# EAGLE design controllerM2 (EAGLE 7.6.0)
CNAME: timebox controller; CREVISION: 1.0; DESIGNER: volzo
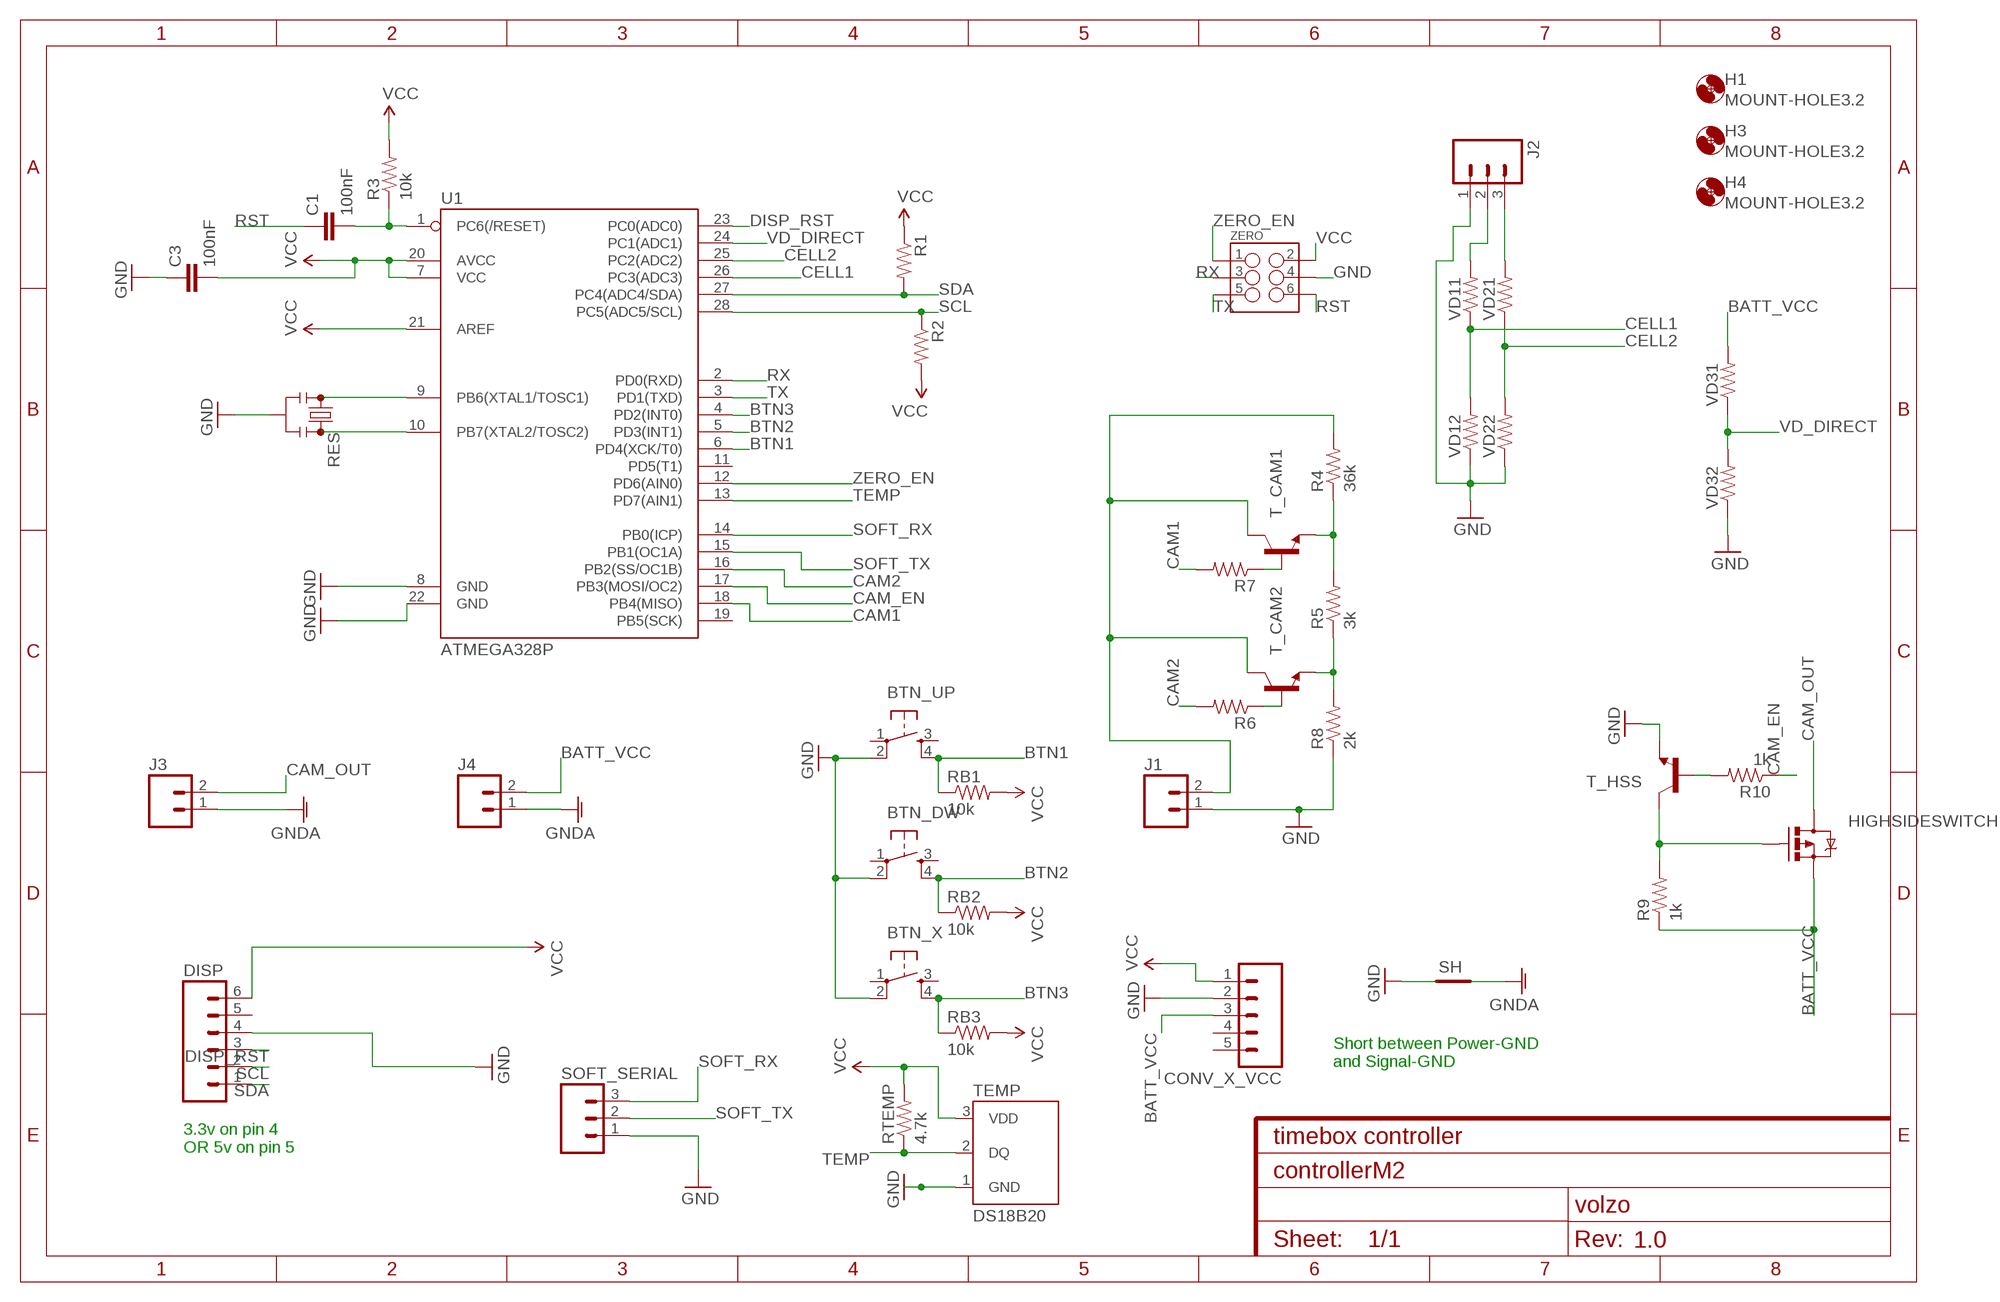
[diagram p0: schematic, sheet 1]

## Parts
BTN_DW  TAC_SWITCHPTH  [TACTILE-PTH]
BTN_UP  TAC_SWITCHPTH  [TACTILE-PTH]
BTN_X  TAC_SWITCHPTH  [TACTILE-PTH]
C1  100nF  CAPPTH  [CAP-PTH-SMALL]
C3  100nF  CAPPTH  [CAP-PTH-SMALL]
CONV_X_VCC  M05LOCK  [1X05_LOCK]
DISP  M06FEMALE_LOCK  [1X06_FEMALE_LOCK.010]
H1  MOUNT-HOLE3.2  [3,2]
H3  MOUNT-HOLE3.2  [3,2]
H4  MOUNT-HOLE3.2  [3,2]
HIGHSIDESWITCH  MOSFET-PCHANNELNDP6020P_20V_24A_LOW_VGS_TH  [TO220V]
J1  M02LOCK  [1X02_LOCK]
J2  M03LOCK  [1X03_LOCK]
J3  M023.5MM_LOCK  [SCREWTERMINAL-3.5MM-2_LOCK]
J4  M023.5MM_LOCK  [SCREWTERMINAL-3.5MM-2_LOCK]
R1  RESISTORAXIAL-0.3  [AXIAL-0.3]
R2  RESISTORAXIAL-0.3  [AXIAL-0.3]
R3  10k  RESISTORAXIAL-0.3  [AXIAL-0.3]
R4  36k  RESISTORAXIAL-0.3  [AXIAL-0.3]
R5  3k  RESISTORAXIAL-0.3  [AXIAL-0.3]
R6  RESISTORAXIAL-0.3  [AXIAL-0.3]
R7  RESISTORAXIAL-0.3  [AXIAL-0.3]
R8  2k  RESISTORAXIAL-0.3  [AXIAL-0.3]
R9  1k  RESISTORAXIAL-0.3  [AXIAL-0.3]
R10  1k  RESISTORAXIAL-0.3  [AXIAL-0.3]
RB1  10k  RESISTORAXIAL-0.3  [AXIAL-0.3]
RB2  10k  RESISTORAXIAL-0.3  [AXIAL-0.3]
RB3  10k  RESISTORAXIAL-0.3  [AXIAL-0.3]
RES  RESONATORPTH  [RESONATOR-PTH]
RTEMP  4.7k  RESISTORAXIAL-0.3  [AXIAL-0.3]
SH  SHORT-HT5  [SHORT_TOP-50]
SOFT_SERIAL  M03LOCK  [1X03_LOCK]
T_CAM1  TRANSISTOR_NPN2N3904  [TO-92]
T_CAM2  TRANSISTOR_NPN2N3904  [TO-92]
T_HSS  TRANSISTOR_NPN2N3904  [TO-92]
TEMP  DS18B20  [TO-92-AMMO]
U1  ATMEGA328P  ATMEGA328P_PDIP  [DIL28-3]
VD11  RESISTORAXIAL-0.3  [AXIAL-0.3]
VD12  RESISTORAXIAL-0.3  [AXIAL-0.3]
VD21  RESISTORAXIAL-0.3  [AXIAL-0.3]
VD22  RESISTORAXIAL-0.3  [AXIAL-0.3]
VD31  RESISTORAXIAL-0.3  [AXIAL-0.3]
VD32  RESISTORAXIAL-0.3  [AXIAL-0.3]
ZERO  M03X2FEMALE  [2X3]

## Nets
BATT_VCC [power]: CONV_X_VCC.3 HIGHSIDESWITCH.3(S) J4.2 R9.P$1 VD31.P$2
BTN1: BTN_UP.4 RB1.P$1 U1.6(PD4(XCK/T0))
BTN2: BTN_DW.4 RB2.P$1 U1.5(PD3(INT1))
BTN3: BTN_X.4 RB3.P$1 U1.4(PD2(INT0))
CAM1: R7.P$2 U1.18(PB4(MISO))
CAM2: R6.P$2 U1.16(PB2(SS/OC1B))
CAM_EN: R10.P$1 U1.17(PB3(MOSI/OC2))
CAM_OUT [power]: HIGHSIDESWITCH.2(D) J3.2
CELL1: U1.26(PC3(ADC3)) VD11.P$1 VD12.P$2
CELL2: U1.25(PC2(ADC2)) VD21.P$1 VD22.P$2
DISP_RST: DISP.3 U1.23(PC0(ADC0))
GND: BTN_DW.2 BTN_UP.2 BTN_X.2 C3.1 CONV_X_VCC.2 DISP.4 J1.1 J2.1 R8.P$1 RES.2 SH.1 SOFT_SERIAL.1 T_HSS.1(E) TEMP.1(GND) U1.8(GND) U1.22(GND) VD12.P$1 VD22.P$1 VD32.P$1 ZERO.4
GNDA [power]: J3.1 J4.1 SH.2
N$1: C1.2 R3.P$1 U1.1(PC6(/RESET))
N$2: J2.2 VD11.P$2
N$3: R7.P$1 T_CAM1.2(B)
N$5: J2.3 VD21.P$2
N$7: J1.2 R4.P$2 T_CAM1.3(C) T_CAM2.3(C)
N$8: RES.3 U1.10(PB7(XTAL2/TOSC2))
N$9: RES.1 U1.9(PB6(XTAL1/TOSC1))
N$11: R6.P$1 T_CAM2.2(B)
N$13: R10.P$2 T_HSS.2(B)
N$14: HIGHSIDESWITCH.1(G) R9.P$2 T_HSS.3(C)
N$16: R4.P$1 R5.P$2 T_CAM1.1(E)
N$17: R5.P$1 R8.P$2 T_CAM2.1(E)
RST: C1.1 ZERO.6
RX: U1.2(PD0(RXD)) ZERO.3
SCL: DISP.2 R2.P$1 U1.28(PC5(ADC5/SCL))
SDA: DISP.1 R1.P$2 U1.27(PC4(ADC4/SDA))
SOFT_RX: SOFT_SERIAL.3 U1.14(PB0(ICP))
SOFT_TX: SOFT_SERIAL.2 U1.15(PB1(OC1A))
TEMP: RTEMP.P$1 TEMP.2(DQ) U1.13(PD7(AIN1))
TX: U1.3(PD1(TXD)) ZERO.5
VCC: C3.2 CONV_X_VCC.1 DISP.6 R1.P$1 R2.P$2 R3.P$2 RB1.P$2 RB2.P$2 RB3.P$2 RTEMP.P$2 TEMP.3(VDD) U1.7(VCC) U1.20(AVCC) U1.21(AREF) ZERO.2
VD_DIRECT: U1.24(PC1(ADC1)) VD31.P$1 VD32.P$2
ZERO_EN: U1.12(PD6(AIN0)) ZERO.1
Unconnected: BTN_DW.1 BTN_DW.3 BTN_UP.1 BTN_UP.3 BTN_X.1 BTN_X.3 CONV_X_VCC.4 CONV_X_VCC.5 DISP.5 U1.11(PD5(T1)) U1.19(PB5(SCK))

## Notes on the sheet
- Short between Power-GND
  and Signal-GND
- 3.3v on pin 4
  OR 5v on pin 5

## Library data of the parts
BTN_DW BTN_UP BTN_X = SparkFun-Retired:TAC_SWITCH: Momentary Switch Button commonly used for reset or general input. Spark Fun Electronics SKU : COM-00097 SMT- SWCH-08247
C1 C3 = SparkFun-Passives:CAP: Capacitor Standard 0603 ceramic capacitor, and 0.1" leaded capacitor.
CONV_X_VCC = SparkFun-Connectors:M05: Header 5 Standard 5-pin 0.1" header. Use with straight break away headers (SKU : PRT-00116), right angle break away headers (PRT-00553), swiss pins (PRT-00743), machine pins (PRT-00117), and female headers (PRT-00115). Molex polarized connector foot print use with SKU : PRT-08230 with associated crimp pins and housings.
DISP = SparkFun-Connectors:M06: Header 6 Standard 6-pin 0.1" header. Use with straight break away headers (SKU : PRT-00116), right angle break away headers (PRT-00553), swiss pins (PRT-00743), machine pins (PRT-00117), and female headers (PRT-00115). Molex polarized connector foot print use with SKU : PRT-08094 with associated crimp pins and housings. NOTES ON THE VARIANTS LOCK and LOCK_LONGPADS... This footprint was designed to help hold the alignment of a through-hole component (i.e. 6-pin header) while soldering it into place. You may notice that each hole has been shifted either up or down by 0.005 of an inch from it's more standard position (which is a perfectly straight line). This slight alteration caused the pins (the squares in the middle) to touch the edges of the holes. Because they are alternating, it causes a "brace" to hold the component in place. 0.005 has proven to be the perfect amount of "off-center" position when using our standard breakaway headers. Although looks a little odd when you look at the bare footprint, once you have a header in there, the alteration is very hard to notice. Also,if you push a header all the way into place, it is covered up entirely on the bottom side. This idea of altering the position of holes to aid alignment will be further integrated into the Sparkfun Library for other footprints. It can help hold any component with 3 or more connection pins.
H1 H3 H4 = holes:MOUNT-HOLE: MOUNTING HOLE with drill center marker
HIGHSIDESWITCH = SparkFun-DiscreteSemi:MOSFET-PCHANNEL: Generic PMOSFET IRLML2244 - TRANS-11153 (SOT-23 -20V -4.3A) (1.Gate 2.Source 3.Drain) FQP27P06 - COM-10349 <http://www.sparkfun.com/products/10349> (TO-220 -60V -27A) (1.Gate 2.Source 3.Drain); PROD_ID: TRANS-13060
J1 = SparkFun-Connectors:M02: Standard 2-pin 0.1" header. Use with - straight break away headers ( PRT-00116) - right angle break away headers (PRT-00553) - swiss pins (PRT-00743) - machine pins (PRT-00117) - female headers (PRT-00115) Molex polarized connector foot print use with: PRT-08233 with associated crimp pins and housings. 2.54_SCREWTERM for use with PRT-10571. 3.5mm Screw Terminal footprints for PRT-08084 5mm Screw Terminal footprints for use with PRT-08432
J2 SOFT_SERIAL = SparkFun-Connectors:M03: Header 3 Standard 3-pin 0.1" header. Use with straight break away headers (SKU : PRT-00116), right angle break away headers (PRT-00553), swiss pins (PRT-00743), machine pins (PRT-00117), and female headers (PRT-00115). Molex polarized connector foot print use with SKU : PRT-08232 with associated crimp pins and housings.
J3 J4 = SparkFun-Connectors:M02: Standard 2-pin 0.1" header. Use with - straight break away headers ( PRT-00116) - right angle break away headers (PRT-00553) - swiss pins (PRT-00743) - machine pins (PRT-00117) - female headers (PRT-00115) Molex polarized connector foot print use with: PRT-08233 with associated crimp pins and housings. 2.54_SCREWTERM for use with PRT-10571. 3.5mm Screw Terminal footprints for PRT-08084 5mm Screw Terminal footprints for use with PRT-08432; PROD_ID: CONN-08399
R1-R10 RB1-RB3 RTEMP VD11 VD12 VD21 VD22 VD31 VD32 = SparkFun-Resistors:RESISTOR: Resistor Basic schematic elements and footprints for 0603, 1206, and PTH resistors.
RES = SparkFun-FreqCtrl:RESONATOR: Resonator Small SMD resonator. Used, eg, on the Arduino Pro/ Pro Mini boards. 8MHz- XTAL-08895 16MHz- XTAL-08900
SH = shorts-old:SHORT-H: Short between two nets; BOM: no
T_CAM1 T_CAM2 T_HSS = SparkFun-DiscreteSemi:TRANSISTOR_NPN: Generic NPN BJT MMBT2222A - TRANS-08049 (SOT-23, 1A 40V) MPSA42 - TRANS-09116 (SOT-23, 500mA 300V) MMBT5088LT1G - TRANS-11160 (SOT-23, 50 mA 30V) BC547 - COM-08928 <http://www.sparkfun.com/products/8928> (TO-92 45V 100mA) (1.Collector 2.Base 3.Emitter) 2N3904 - COM-00521 <http://www.sparkfun.com/products/521> (TO-92 40V 200mA) (1.Emitter 2.Base 3.Collector) P2N2222A - COM-12852 <http://www.sparkfun.com/products/12852> (TO-92 40V 600mA) (1.Collector 2.Base 3.Emitter); PROD_ID: TRANS-08447
TEMP = SparkFun-Sensors:DS18B20: Dallas/Maxim DS18B20 1-wire temperature sensor Datasheet: http://datasheets.maximintegrated.com/en/ds/DS18B20.pdf temp thermometer 1-wire one-wire one wire; STORE_ID: SEN-00245
U1 = SparkFun-DigitalIC:ATMEGA328P_PDIP: uC used in the Arduino 32kb flash, 1k EEPROM, 2k SRAM This is the through-hole version of this chip.
ZERO = SparkFun-Connectors:M03X2: 2x3 .1" header. Shrouded, with keying- CONN-10681 SMT- CONN-11415 Pogo pins- HW-11044; PROD_ID: CONN-11566; VALUE: FEMALE 2x3

## Net classes
0 default: width 0.305 mm, clearance 0.254 mm
1 power: width 0.762 mm, clearance 0.254 mm

## Board
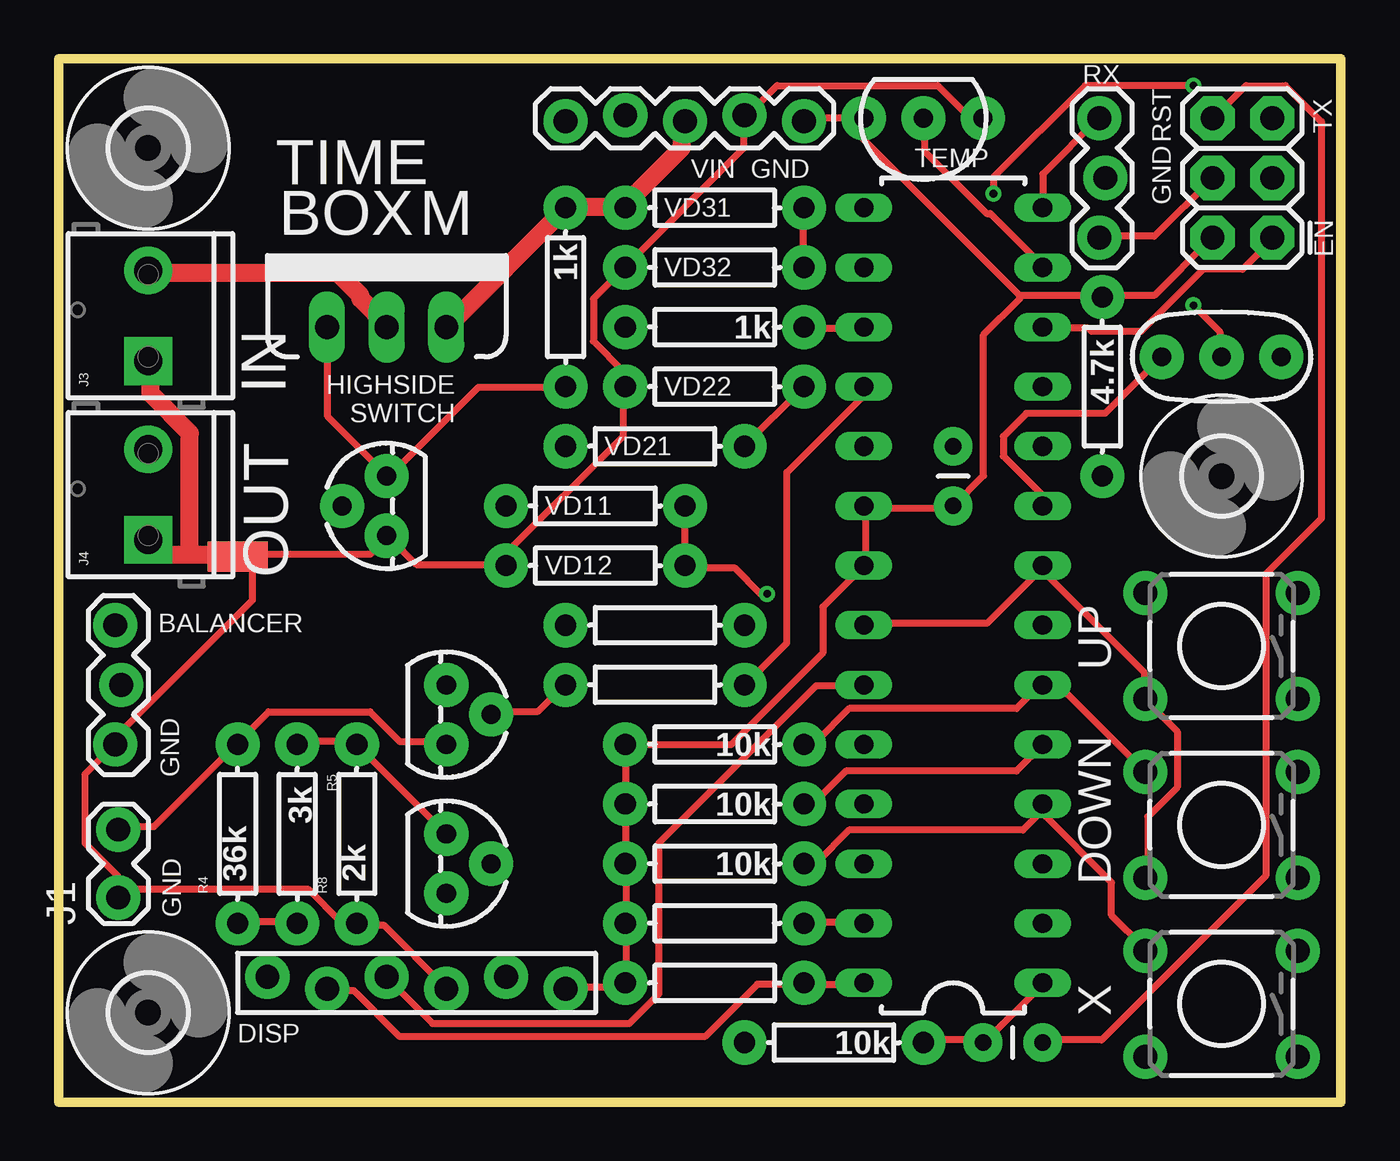
[diagram p1: board, top side]
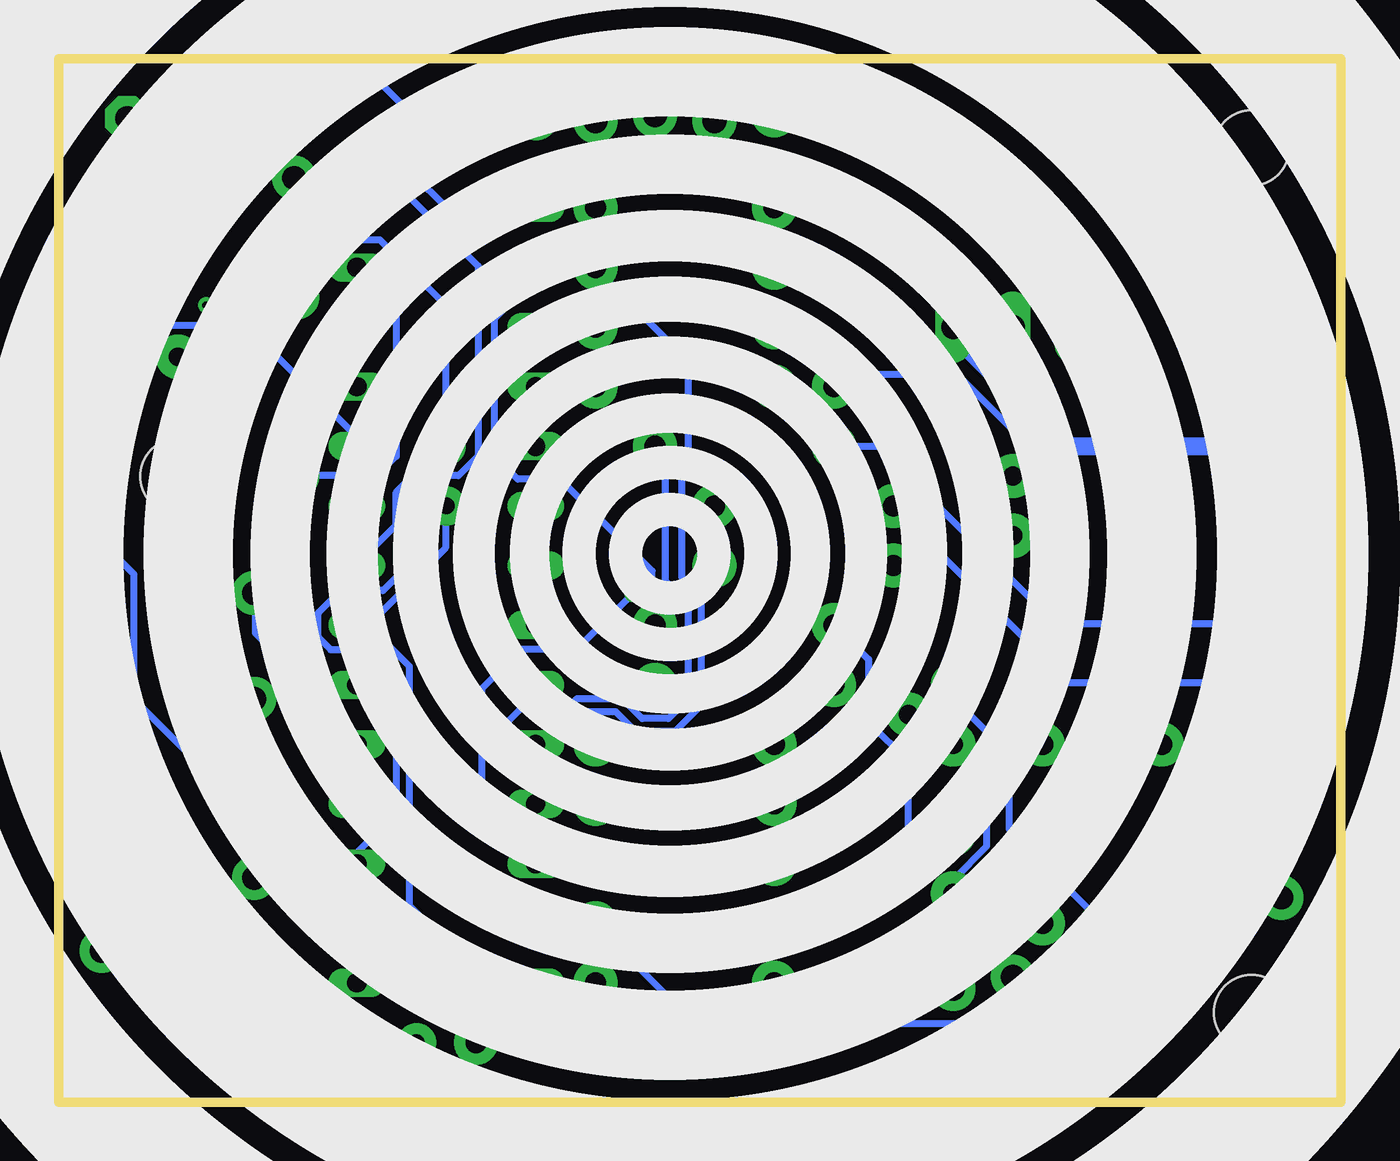
[diagram p2: board, bottom side, seen from below]

Size 54.61 x 44.45 mm. Coordinates in mm from the lower left corner, seen from the top.
Outline: 0,0 54.61,0 54.61,44.45 0,44.45 0,0
Copper layers (1*16): Top 0.0356mm / dielectric 1.5011mm / Bottom 0.0356mm
Design rules "oshpark-2layer *": minimum track width 6mil, minimum drill 13mil, track to track 10mil, track to pad 10mil, pad to pad 10mil, via to via 10mil, smd to smd 10mil, copper to edge 15mil, drill to drill 6mil, minimum pad ring 7mil, minimum via ring 7mil, stop-mask expansion 2.5mil, vias tented up to drill 0mil, thermal gap 10mil

### Footprints (pad centres in the part's own frame; a part is rotated, then mirrored left to right if it is on the bottom)
TACTILE-PTH = drill 1.016 pad 1.88: 1 -3.251,2.261; 2 3.251,2.261; 3 -3.251,-2.261; 4 3.251,-2.261
CAP-PTH-SMALL = drill 0.7 pad 1.651: 1 0,0; 2 2.54,0
1X05_LOCK = drill 1.016 pad 1.88: 1 0,0.127; 2 2.54,-0.127; 3 5.08,0.127; 4 7.62,-0.127; 5 10.16,0.127
1X06_FEMALE_LOCK.010 = drill 1.016 pad 1.88: 1 0,0.254; 2 2.54,-0.254; 3 5.08,0.254; 4 7.62,-0.254; 5 10.16,0.254; 6 12.7,-0.254
3,2 = hole 3.2: 0,0
TO220V = drill 1.016 long: 1 -2.54,0; 2 0,0; 3 2.54,0
1X02_LOCK = drill 1.016 pad 1.88: 1 -0.178,0; 2 2.718,0
1X03_LOCK = drill 1.016 pad 1.88: 1 0,0.127; 2 2.54,-0.127; 3 5.08,0.127
SCREWTERMINAL-3.5MM-2_LOCK = drill 1.2 pad 2.032 square: 1 -0.178,0 | drill 1.2 pad 2.032: 2 3.678,0
AXIAL-0.3 = drill 0.9 pad 1.88: P$1 -3.81,0; P$2 3.81,0
RESONATOR-PTH = drill 0.8 pad 1.88: 1 -2.54,0; 2 0,0; 3 2.54,0
SHORT_TOP-50 = smd 1.27 x 1.27: 1 0.635,0; 2 -0.635,0
TO-92 = drill 0.813 pad 1.88: 1 -1.27,0; 2 0,1.905; 3 1.27,0
TO-92-AMMO = drill 0.813 pad 1.88: 1 -2.54,0; 2 0,0; 3 2.54,0
DIL28-3 = drill 0.813 long: 1 -16.51,-3.81; 2 -13.97,-3.81; 3 -11.43,-3.81; 4 -8.89,-3.81; 5 -6.35,-3.81; 6 -3.81,-3.81; 7 -1.27,-3.81; 8 1.27,-3.81; 9 3.81,-3.81; 10 6.35,-3.81; 11 8.89,-3.81; 12 11.43,-3.81; 13 13.97,-3.81; 14 16.51,-3.81; 15 16.51,3.81; 16 13.97,3.81; 17 11.43,3.81; 18 8.89,3.81; 19 6.35,3.81; 20 3.81,3.81; 21 1.27,3.81; 22 -1.27,3.81; 23 -3.81,3.81; 24 -6.35,3.81; 25 -8.89,3.81; 26 -11.43,3.81; 27 -13.97,3.81; 28 -16.51,3.81
2X3 = drill 1.016 pad 1.88 octagon: 1 0,0; 2 0,2.54; 3 2.54,0; 4 2.54,2.54; 5 5.08,0; 6 5.08,2.54

### Placement (x,y rotation side)
BTN_DW  49.53,19.43 180 top
BTN_UP  49.53,11.81 180 top
BTN_X  49.53,4.19 180 top
C1  41.91,2.54 180 top
C3  38.1,27.94 270 top
CONV_X_VCC  31.75,41.91 180 top
DISP  8.89,5.08 0 top
H1  3.81,40.64 0 top
H3  49.53,26.67 0 top
H4  3.81,3.81 0 top
HIGHSIDESWITCH  13.97,33.02 0 top
J1  2.54,8.89 90 top
J2  2.54,15.24 90 top
J3  3.81,31.75 90 top
J4  3.81,24.13 90 top
R1  27.94,7.62 0 top
R2  27.94,5.08 180 top
R3  33.02,2.54 180 top
R4  7.62,11.43 90 top
R5  10.16,11.43 270 top
R6  25.4,20.32 0 top
R7  25.4,17.78 0 top
R8  12.7,11.43 90 top
R9  21.59,34.29 270 top
R10  27.94,33.02 180 top
RB1  27.94,15.24 180 top
RB2  27.94,12.7 180 top
RB3  27.94,10.16 180 top
RES  49.53,31.75 0 top
RTEMP  44.45,30.48 90 top
SH  7.62,23.24 0 top
SOFT_SERIAL  44.45,36.83 90 top
T_CAM1  16.51,16.51 270 top
T_CAM2  16.51,10.16 270 top
T_HSS  13.97,25.4 90 top
TEMP  36.83,41.91 180 top
U1  38.1,21.59 90 top
VD11  22.86,25.4 180 top
VD12  22.86,22.86 0 top
VD21  25.4,27.94 180 top
VD22  27.94,30.48 0 top
VD31  27.94,38.1 180 top
VD32  27.94,35.56 0 top
ZERO  51.69,36.83 90 top

### Tracks (layer width: path | path; a pad name or v marks a point on that pad's centre or on a via)
BATT_VCC
  Top 0.762: HIGHSIDESWITCH.3 16.62,33.11 21.51,38 R9.P$1 21.93,38.14 24.03,38.14 VD31.P$2 24.31,38.42 26.54,40.65 26.54,41.77 CONV_X_VCC.3
  Bottom 0.762: J4.2 3.91,27.94 11.73,27.94 16.48,32.69 16.48,32.97 HIGHSIDESWITCH.3
BTN1
  Top 0.305: BTN_UP.4 42.61,17.74 41.91,17.74 U1.6 41.77,17.74 40.79,16.76 33.67,16.76 32.27,15.37 31.85,15.37 RB1.P$1
BTN2
  Top 0.305: RB2.P$1 31.85,12.71 32.13,12.71 33.53,14.11 40.79,14.11 41.91,15.23 U1.5
  Bottom 0.305: U1.5 41.91,15.65 46.24,19.98 46.24,21.65 BTN_DW.4
BTN3
  Top 0.305: BTN_X.4 46.24,6.57 44.84,7.96 44.84,9.36 41.91,12.29 U1.4 41.77,12.29 41.07,11.6 33.67,11.6 32.27,10.2 31.85,10.2 RB3.P$1
CAM1
  Top 0.305: U1.18 34.23,30.45 34.23,30.04 31.01,26.82 31.01,19.56 29.34,17.88 R7.P$2
CAM2
  Bottom 0.305: U1.16 34.37,35.48 34.37,35.06 36.04,33.39 36.04,27.52 35.06,26.54 33.25,26.54 29.34,22.63 29.34,20.4 R6.P$2
CAM_EN
  Top 0.305: U1.17 34.23,32.97 31.85,32.97 R10.P$1
CAM_OUT
  Top 0.762: HIGHSIDESWITCH.2 13.97,33.11 12.85,34.23 12.85,34.37 11.87,35.34 3.91,35.34 J3.2
CELL1  (via drill 0.33)
  Top 0.305: v30.18,21.65 29.9,21.65 28.78,22.77 26.68,22.77 VD12.P$2 26.68,22.91 26.68,25.29 VD11.P$1
  Bottom 0.305: v30.18,21.65 32.55,19.28 34.92,19.28 36.6,17.6 36.6,12.85 34.37,10.62 34.37,10.2 U1.26
CELL2
  Top 0.305: VD22.P$2 31.71,30.45 29.2,27.94 VD21.P$1
  Bottom 0.305: U1.25 34.37,12.71 34.37,13.13 36.04,14.81 36.04,15.65 34.92,16.76 32.97,16.76 32.55,17.18 30.59,17.18 29.76,16.34 28.64,16.34 27.8,17.18 27.8,21.23 28.78,22.21 28.78,27.52 29.2,27.94 VD21.P$1
DISP_RST
  Top 0.305: U1.23 34.23,17.74 32.27,17.74 25.57,11.04 25.57,4.61 24.31,3.35 15.93,3.35 13.97,5.31 DISP.3
GND  (via drill 0.33)
  Top 0.305: U1.22 34.37,20.4 39.53,20.4 41.91,22.77 U1.8 41.91,22.63 46.24,18.3 46.24,17.18 BTN_DW.2 46.38,17.04 47.64,15.79 47.64,13.41 46.38,12.15 46.38,9.64 BTN_UP.2 | DISP.4 16.48,4.89 13.83,7.54 12.71,7.54 R8.P$1 12.57,7.68 12.01,7.68 10.62,9.08 2.65,9.08 J1.1 2.52,8.8 2.52,9.64 1.12,11.04 1.12,13.97 2.38,15.23 J2.1 2.52,15.37 2.52,15.65 8.24,21.37 8.24,23.19 SH.1 8.38,23.33 13.27,23.33 13.97,24.03 T_HSS.1 14.11,24.03 15.23,22.91 19,22.91 VD12.P$1 19,23.05 19,23.33 24.03,28.36 24.03,30.45 VD22.P$1 24.03,30.59 24.03,31.15 22.77,32.41 22.77,34.23 24.03,35.48 VD32.P$1 24.17,35.62 29.2,40.65 29.2,41.91 CONV_X_VCC.2 29.34,42.05 30.59,43.31 37.44,43.31 38.84,41.91 TEMP.1 | ZERO.4 46.66,36.88 44.42,36.88 SOFT_SERIAL.1 | v48.34,33.95 49.45,32.83 49.45,31.85 RES.2
  Bottom 0.305: BTN_X.2 46.38,1.96 46.38,4.61 47.64,5.87 47.64,8.24 46.38,9.5 BTN_UP.2 | U1.8 41.91,22.91 40.23,24.59 40.23,25.98 38.98,27.24 38.84,27.24 38.14,27.94 C3.1 38.14,28.08 38.14,33.95 40.93,36.74 44.28,36.74 SOFT_SERIAL.1 44.42,36.74 47.22,33.95 v48.34,33.95 | ZERO.4 49.03,39.4 48.76,39.4 44.84,43.31 40.79,43.31 39.4,41.91 TEMP.1
GNDA
  Top 0.762: 5.59,23.33 4.47,23.33 3.91,23.89 J4.1 | 5.59,23.33 6.99,23.33 SH.2 | 5.59,23.33 5.59,28.5 3.91,30.18 3.91,31.57 J3.1
N$1
  Top 0.305: U1.1 41.91,5.03 39.4,2.52 C1.2 39.26,2.65 36.88,2.65 R3.P$1
N$2
  Bottom 0.305: J2.2 2.79,17.88 11.6,17.88 19,25.29 VD11.P$2
N$3
  Top 0.305: T_CAM1.2 18.44,16.62 20.4,16.62 21.51,17.74 R7.P$1
N$5
  Bottom 0.305: VD21.P$2 19.56,27.94 17.6,25.98 17.6,25.84 12.15,20.4 2.52,20.4 J2.3
N$7
  Top 0.305: J1.2 2.65,11.73 4.05,11.73 7.54,15.23 R4.P$2 7.68,15.37 8.94,16.62 13.27,16.62 14.53,15.37 16.48,15.37 T_CAM1.3
  Bottom 0.305: T_CAM2.3 16.48,8.94 16.48,9.5 15.09,10.9 15.09,13.83 16.48,15.23 T_CAM1.3
N$8
  Bottom 0.305: U1.10 41.91,28.36 45.54,31.99 45.54,32.27 46.38,33.11 50.71,33.11 RES.3
N$9
  Top 0.305: U1.9 41.91,25.84 40.23,27.52 40.23,28.36 41.21,29.34 44.56,29.34 46.94,31.71 RES.1
N$11
  Bottom 0.305: T_CAM2.2 18.44,10.2 18.44,14.53 20.12,16.2 20.12,18.86 21.51,20.26 R6.P$1
N$13
  Bottom 0.305: T_HSS.2 12.15,25.43 12.15,26.82 16.34,31.01 20.12,31.01 22.07,32.97 24.03,32.97 R10.P$2
N$14
  Top 0.305: HIGHSIDESWITCH.1 11.46,32.97 11.46,29.2 13.97,26.68 T_HSS.3 14.11,26.68 17.88,30.45 21.51,30.45 R9.P$2
N$16
  Top 0.305: R4.P$1 7.68,7.68 10.06,7.68 R5.P$2
  Bottom 0.305: T_CAM1.1 16.48,17.74 16.48,17.18 14.11,14.81 14.11,11.6 10.2,7.68 R5.P$2
N$17
  Top 0.305: R5.P$1 10.2,15.37 12.57,15.37 R8.P$2 T_CAM2.1
RST
  Top 0.305: C1.1 41.91,2.65 44.42,2.65 51.41,9.64 51.41,22.49 53.78,24.87 53.78,41.77 52.25,43.31 50.57,43.31 49.17,41.91 ZERO.6
RX
  Bottom 0.305: U1.2 41.91,7.68 51.41,17.18 51.41,22.49 53.78,24.87 53.78,37.16 51.69,39.26 ZERO.3
SCL
  Top 0.305: U1.28 34.23,5.03 31.85,5.03 R2.P$1 31.71,5.03 29.76,5.03 27.52,2.79 14.53,2.79 12.57,4.75 11.46,4.75 DISP.2
SDA
  Top 0.305: U1.27 34.23,7.68 31.85,7.68 R1.P$2
  Bottom 0.305: DISP.1 8.94,5.31 10.9,3.35 27.52,3.35 31.71,7.54 R1.P$2
SOFT_RX
  Top 0.305: U1.14 41.91,39.53 44.28,41.91 SOFT_SERIAL.3
SOFT_TX
  Bottom 0.305: U1.15 34.37,38.14 38.14,38.14 39.53,39.53 44.42,39.53 44.56,39.4 SOFT_SERIAL.2
TEMP
  Top 0.305: U1.13 41.91,35.62 39.67,37.86 39.53,37.86 36.88,40.51 36.88,41.91 TEMP.2
  Bottom 0.305: RTEMP.P$1 44.42,26.68 41.07,26.68 40.23,27.52 40.23,33.81 41.91,35.48 U1.13
TX  (via drill 0.33)
  Top 0.305: v39.81,38.7 39.81,39.4 43.73,43.31 v48.34,43.31
  Bottom 0.305: U1.3 41.91,10.62 40.23,12.29 40.23,18.16 41.35,19.28 43.03,19.28 43.59,19.84 43.59,20.82 42.61,21.79 40.79,21.79 39.4,23.19 39.4,25.98 38.7,26.68 37.58,26.68 36.74,27.52 36.74,35.62 v39.81,38.7 | v48.34,43.31 50.29,43.31 ZERO.5
VCC
  Top 0.305: CONV_X_VCC.1 31.85,41.91 TEMP.3 34.23,41.77 34.23,41.07 40.93,34.37 | ZERO.2 49.03,36.74 46.66,34.37 44.56,34.37 RTEMP.P$2 44.42,34.37 40.93,34.37 | DISP.6 21.65,4.89 23.89,4.89 24.03,5.03 R2.P$2 24.17,5.17 24.17,7.54 R1.P$1 24.17,7.68 24.17,10.06 RB3.P$2 24.17,10.2 24.17,12.57 RB2.P$2 24.17,12.85 24.17,15.23 RB1.P$2 24.31,15.23 28.64,15.23 32.55,19.14 32.55,21.09 34.23,22.77 U1.21 34.37,22.91 34.37,25.29 U1.20 34.51,25.29 38,25.29 C3.2 38.14,25.43 39.4,26.68 39.4,32.69 40.93,34.23 40.93,34.37
  Bottom 0.305: C3.2 38.14,25.29 38.14,23.61 41.35,20.4 41.91,20.4 U1.7 41.35,20.26 39.67,18.58 39.67,8.38 33.95,2.65 29.34,2.65 R3.P$2
VD_DIRECT
  Top 0.305: VD31.P$1 31.71,38 31.71,35.62 VD32.P$2
  Bottom 0.305: U1.24 34.23,15.37 33.53,15.37 32.27,16.62 30.87,16.62 30.04,15.79 28.36,15.79 27.24,16.9 27.24,21.51 28.08,22.35 28.08,27.1 27.8,27.38 27.8,31.57 31.71,35.48 VD32.P$2
ZERO_EN
  Top 0.305: U1.12 41.91,32.97 43.87,32.97 44.01,32.83 46.1,32.83 48.76,35.48 50.43,35.48 51.69,36.74 ZERO.1

### Text on the board
tPlace: RX | TIME | TEMP | RST | TX | BOX | M | VIN | GND | VD31 | GND | EN | VD32 | IN | HIGHSIDE / SWITCH | VD22 | VD21 | VD11 | OUT | VD12 | BALANCER | UP | GND | DOWN | GND | X | DISP